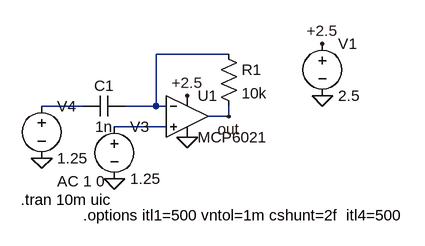
[diagram p0: schematic Draft3.asc]
Draft3.asc, the LTspice schematic file:
Version 4
SHEET 1 880 680
WIRE 256 32 144 32
WIRE 32 112 -32 112
WIRE 144 112 144 32
WIRE 144 112 96 112
WIRE 160 112 144 112
WIRE 256 128 256 112
WIRE 256 128 224 128
WIRE 160 144 80 144
FLAG 192 160 0
FLAG 192 96 +2.5
FLAG 400 96 0
FLAG 400 16 +2.5
FLAG 80 224 0
FLAG -32 192 0
FLAG 256 128 out
SYMBOL SBORKA\\OPamp\\MCP6021 192 128 R0
SYMATTR InstName U1
SYMBOL voltage 400 0 R0
WINDOW 123 0 0 Left 2
WINDOW 39 0 0 Left 2
SYMATTR InstName V1
SYMATTR Value 2.5
SYMBOL voltage 80 128 R0
WINDOW 123 0 0 Left 2
WINDOW 39 0 0 Left 2
SYMATTR InstName V3
SYMATTR Value 1.25
SYMBOL voltage -32 96 R0
WINDOW 123 24 132 Left 2
WINDOW 39 0 0 Left 2
SYMATTR Value2 AC 1 0
SYMATTR InstName V4
SYMATTR Value 1.25
SYMBOL cap 96 96 R90
WINDOW 0 0 32 VBottom 2
WINDOW 3 32 32 VTop 2
SYMATTR InstName C1
SYMATTR Value 1n
SYMBOL res 240 16 R0
SYMATTR InstName R1
SYMATTR Value 10k
TEXT -64 256 Left 2 !.tran 10m uic
TEXT 32 280 Left 2 !.options itl1=500 vntol=1m cshunt=2f  itl4=500

The netlist it stands for:
* Draft3.asc
* U1: MCP6021 (symbol SBORKA\OPamp\MCP6021 not available, pins judged from their places): In+=N003 In-=N001 V+=+2.5 V-=0 OUT=out
V1 +2.5 0 2.5
V3 N003 0 1.25
V4 N002 0 1.25 AC 1 0
C1 N001 N002 1n
R1 N001 out 10k
.tran 10m uic
.options itl1=500 vntol=1m cshunt=2f  itl4=500
.backanno
.end